# EAGLE schematic Mod Matrix Mixer 2x4x2 (EAGLE 6.1)
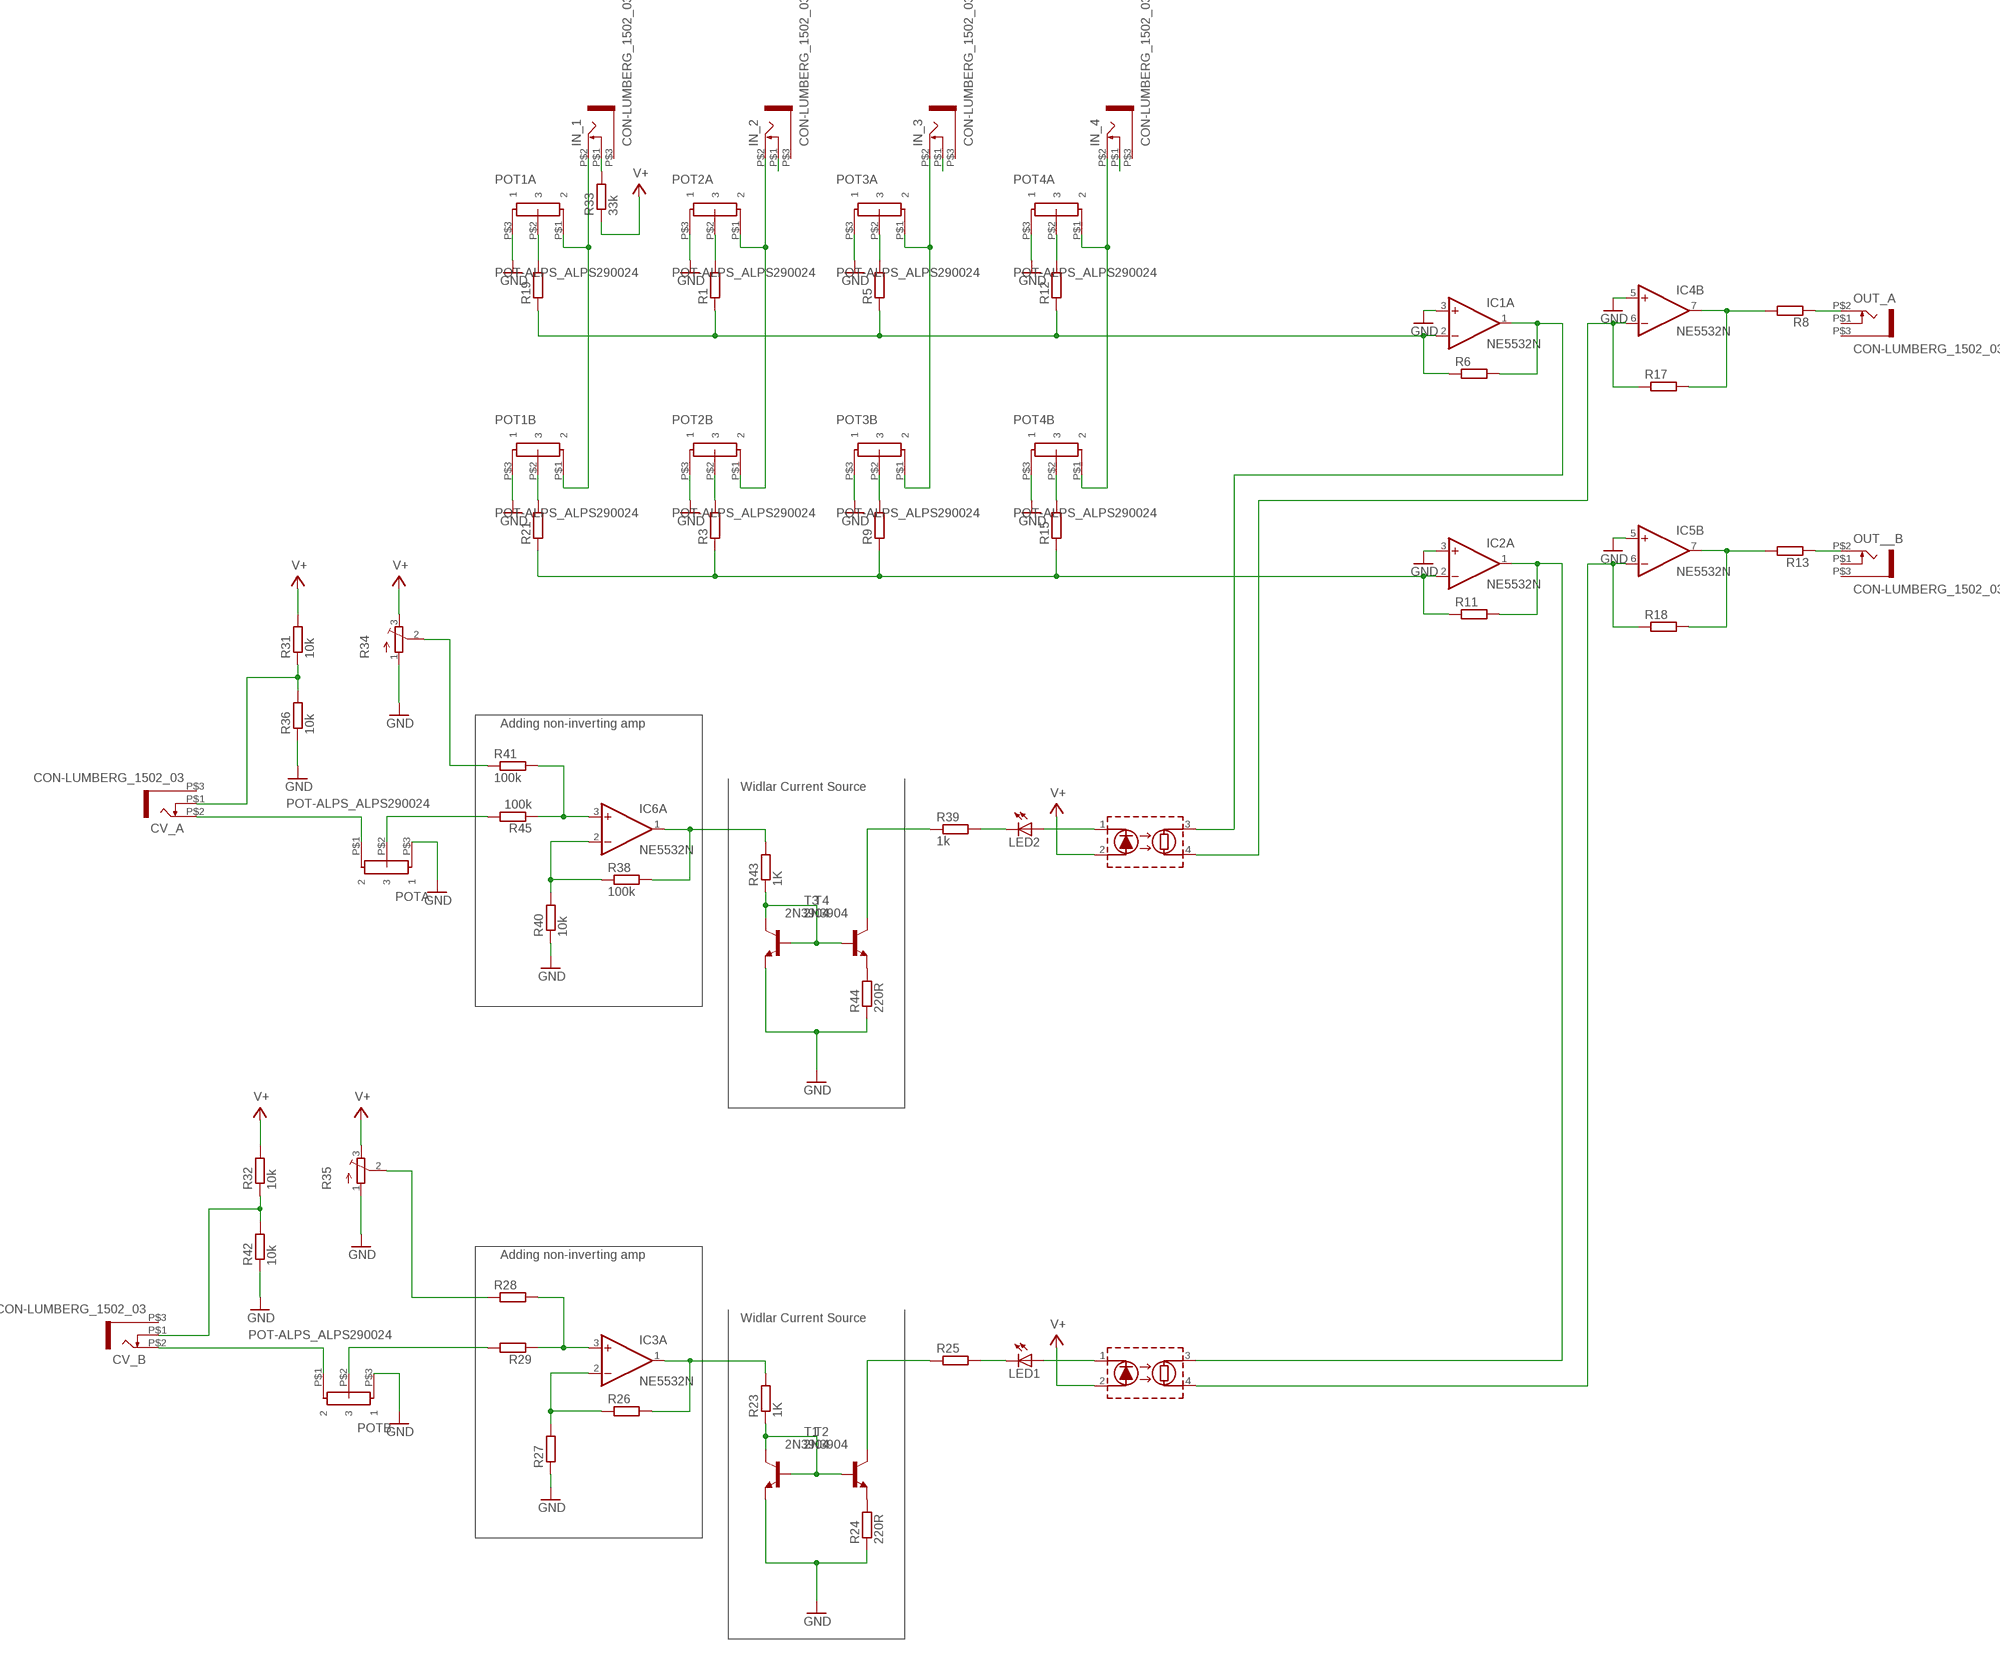
[diagram p0: schematic, sheet 1]

## Parts
CV_A  CON-LUMBERG_1502_03  [CON-LUMBERG_1502_03]
CV_B  CON-LUMBERG_1502_03  [CON-LUMBERG_1502_03]
IC1  NE5532N  [DIL08]
IC2  NE5532N  [DIL08]
IC3  NE5532N  [DIL08]
IC4  NE5532N  [DIL08]
IC5  NE5532N  [DIL08]
IC6  NE5532N  [DIL08]
IN_1  CON-LUMBERG_1502_03  [CON-LUMBERG_1502_03]
IN_2  CON-LUMBERG_1502_03  [CON-LUMBERG_1502_03]
IN_3  CON-LUMBERG_1502_03  [CON-LUMBERG_1502_03]
IN_4  CON-LUMBERG_1502_03  [CON-LUMBERG_1502_03]
LED1  LED5MM  [LED5MM]
LED2  LED5MM  [LED5MM]
OUT__B  CON-LUMBERG_1502_03  [CON-LUMBERG_1502_03]
OUT_A  CON-LUMBERG_1502_03  [CON-LUMBERG_1502_03]
POT1A  POT-ALPS_ALPS290024  [POT-ALPS_POT]
POT1B  POT-ALPS_ALPS290024  [POT-ALPS_POT]
POT2A  POT-ALPS_ALPS290024  [POT-ALPS_POT]
POT2B  POT-ALPS_ALPS290024  [POT-ALPS_POT]
POT3A  POT-ALPS_ALPS290024  [POT-ALPS_POT]
POT3B  POT-ALPS_ALPS290024  [POT-ALPS_POT]
POT4A  POT-ALPS_ALPS290024  [POT-ALPS_POT]
POT4B  POT-ALPS_ALPS290024  [POT-ALPS_POT]
POTA  POT-ALPS_ALPS290024  [POT-ALPS_POT]
POTB  POT-ALPS_ALPS290024  [POT-ALPS_POT]
R1  R-EU_0411/15  [0411/15]
R3  R-EU_0411/15  [0411/15]
R5  R-EU_0411/15  [0411/15]
R6  R-EU_0411/15  [0411/15]
R8  R-EU_0411/15  [0411/15]
R9  R-EU_0411/15  [0411/15]
R11  R-EU_0411/15  [0411/15]
R12  R-EU_0411/15  [0411/15]
R13  R-EU_0411/15  [0411/15]
R15  R-EU_0411/15  [0411/15]
R17  R-EU_0411/15  [0411/15]
R18  R-EU_0411/15  [0411/15]
R19  R-EU_0411/15  [0411/15]
R21  R-EU_0411/15  [0411/15]
R23  1K  R-EU_0411/15  [0411/15]
R24  220R  R-EU_0411/15  [0411/15]
R25  R-EU_0411/15  [0411/15]
R26  R-EU_0411/15  [0411/15]
R27  R-EU_0411/15  [0411/15]
R28  R-EU_0411/15  [0411/15]
R29  R-EU_0411/15  [0411/15]
R31  10k  R-EU_0411/15  [0411/15]
R32  10k  R-EU_0411/15  [0411/15]
R33  33k  R-EU_0411/15  [0411/15]
R34  TRIM_EU-3223W  [3223W]
R35  TRIM_EU-3223W  [3223W]
R36  10k  R-EU_0411/15  [0411/15]
R38  100k  R-EU_0411/15  [0411/15]
R39  1k  R-EU_0411/15  [0411/15]
R40  10k  R-EU_0411/15  [0411/15]
R41  100k  R-EU_0411/15  [0411/15]
R42  10k  R-EU_0411/15  [0411/15]
R43  1K  R-EU_0411/15  [0411/15]
R44  220R  R-EU_0411/15  [0411/15]
R45  100k  R-EU_0411/15  [0411/15]
T1  2N3904  [TO92]
T2  2N3904  [TO92]
T3  2N3904  [TO92]
T4  2N3904  [TO92]
U$1  VTL5C3  [VTL5C3]
U$2  VTL5C3  [VTL5C3]

## Nets
GND: IC1.3(A:+IN) IC2.3(A:+IN) IC4.5(B:+IN) IC5.5(B:+IN) POT1A.P$3 POT1B.P$3 POT2A.P$3 POT2B.P$3 POT3A.P$3 POT3B.P$3 POT4A.P$3 POT4B.P$3 POTA.P$3 POTB.P$3 R24.1 R27.1 R34.1(A) R35.1(A) R36.1 R40.1 R42.1 R44.1 T2.3(E) T4.3(E)
IN_C: IN_3.P$1
N$1: IC4.7(B:OUT) R8.2 R17.2
N$2: IN_2.P$2 POT2A.P$1 POT2B.P$1
N$3: IC2.1(A:OUT) R11.2 U$1.3(LDRA)
N$4: IC1.1(A:OUT) R6.2 U$2.3(LDRA)
N$5: OUT_A.P$2 R8.1
N$6: OUT__B.P$2 R13.1
N$7: POT1A.P$2 R19.2
N$8: POT1B.P$2 R21.2
N$10: IN_2.P$1
N$11: IC4.6(B:-IN) R17.1 U$2.4(LDRB)
N$12: POT2A.P$2 R1.2
N$13: POT2B.P$2 R3.2
N$14: IC5.7(B:OUT) R13.2 R18.2
N$15: LED1.A U$1.1(LED-)
N$16: LED1.K(C) R25.2
N$17: IC3.1(A:OUT) R23.2 R26.2
N$18: POTA.P$2 R45.2
N$19: IN_3.P$2 POT3A.P$1 POT3B.P$1
N$21: POT3A.P$2 R5.2
N$22: POT3B.P$2 R9.2
N$23: CV_A.P$2 POTA.P$1
N$24: CV_A.P$1 R31.1 R36.2
N$25: IN_4.P$2 POT4A.P$1 POT4B.P$1
N$26: IN_1.P$2 POT1A.P$1 POT1B.P$1
N$27: R24.2 T1.3(E)
N$28: R23.1 T1.2(B) T2.1(C) T2.2(B)
N$29: R25.1 T1.1(C)
N$30: IC3.2(A:-IN) R26.1 R27.2
N$31: R28.1 R35.2(S)
N$32: IC3.3(A:+IN) R28.2 R29.1
N$34: IN_4.P$1
N$35: R44.2 T3.3(E)
N$36: IC5.6(B:-IN) R18.1 U$1.4(LDRB)
N$37: POTB.P$2 R29.2
N$38: CV_B.P$2 POTB.P$1
N$39: LED2.A U$2.1(LED-)
N$40: LED2.K(C) R39.2
N$41: R39.1 T3.1(C)
N$42: IC6.1(A:OUT) R38.2 R43.2
N$43: IN_1.P$1 R33.2
N$44: R43.1 T3.2(B) T4.1(C) T4.2(B)
N$45: POT4A.P$2 R12.2
N$46: POT4B.P$2 R15.2
N$47: CV_B.P$1 R32.1 R42.2
N$48: IC6.2(A:-IN) R38.1 R40.2
N$50: IC6.3(A:+IN) R41.2 R45.1
N$51: R34.2(S) R41.1
N$52: IC1.2(A:-IN) R1.1 R5.1 R6.1 R12.1 R19.1
N$54: IC2.2(A:-IN) R3.1 R9.1 R11.1 R15.1 R21.1
V+: R31.2 R32.2 R33.1 R34.3(E) R35.3(E) U$1.2(LED+) U$2.2(LED+)
Unconnected: CV_A.P$3 CV_B.P$3 IC1.5(B:+IN) IC1.6(B:-IN) IC1.7(B:OUT) IC2.5(B:+IN) IC2.6(B:-IN) IC2.7(B:OUT) IC3.5(B:+IN) IC3.6(B:-IN) IC3.7(B:OUT) IC4.1(A:OUT) IC4.2(A:-IN) IC4.3(A:+IN) IC5.1(A:OUT) IC5.2(A:-IN) IC5.3(A:+IN) IC6.5(B:+IN) IC6.6(B:-IN) IC6.7(B:OUT) IN_1.P$3 IN_2.P$3 IN_3.P$3 IN_4.P$3 OUT__B.P$1 OUT__B.P$3 OUT_A.P$1 OUT_A.P$3

## Notes on the sheet
- Adding non-inverting amp
- Widlar Current Source
- Adding non-inverting amp
- Widlar Current Source

## Power pins joined to a net without a drawn wire
V+: IC1.8(P:V+) IC2.8(P:V+) IC3.8(P:V+) IC4.8(P:V+) IC5.8(P:V+) IC6.8(P:V+)
V-: IC1.4(P:V-) IC2.4(P:V-) IC3.4(P:V-) IC4.4(P:V-) IC5.4(P:V-) IC6.4(P:V-)

## Library data of the parts
CV_A CV_B IN_1-IN_4 OUT__B OUT_A = Rebel:CON-LUMBERG_1502_03
IC1-IC6 = linear:NE5532: AUDIO AMPLIFIER
LED1 LED2 = led:LED: LED OSRAM: - CHIPLED LG R971, LG N971, LY N971, LG Q971, LY Q971, LO R971, LY R971 LH N974, LH R974 LS Q976, LO Q976, LY Q976 LO Q996 - Hyper CHIPLED LW Q18S LB Q993, LB Q99A, LB R99A - SideLED LS A670, LO A670, LY A670, LG A670, LP A670 LB A673, LV A673, LT A673, LW A673 LH A674 LY A675 LS A676, LA A676, LO A676, LY A676, LW A676 LS A679, LY A679, LG A679 - Hyper Micro SIDELED® LS Y876, LA Y876, LO Y876, LY Y876 LT Y87S - SmartLED LW L88C, LW L88S LB L89C, LB L89S, LG L890 LS L89K, LO L89K, LY L89K LS L896, LA L896, LO L896, LY L896 - TOPLED LS T670, LO T670, LY T670, LG T670, LP T670 LSG T670, LSP T670, LSY T670, LOP T670, LYG T670 LG T671, LOG T671, LSG T671 LB T673, LV T673, LT T673, LW T673 LH T674 LS T676, LA T676, LO T676, LY T676, LB T676, LH T676, LSB T676, LW T676 LB T67C, LV T67C, LT T67C, LS T67K, LO T67K, LY T67K, LW E67C LS E67B, LA E67B, LO E67B, LY E67B, LB E67C, LV E67C, LT E67C LW T67C LS T679, LY T679, LG T679 LS T770, LO T770, LY T770, LG T770, LP T770 LB T773, LV T773, LT T773, LW T773 LH T774 LS E675, LA E675, LY E675, LS T675 LS T776, LA T776, LO T776, LY T776, LB T776 LHGB T686 LT T68C, LB T68C - Hyper Mini TOPLED® LB M676 - Mini TOPLED Santana® LG M470 LS M47K, LO M47K, LY M47K Source: http://www.osram.convergy.de LUXEON: - LUMILED® LXK2-PW12-R00, LXK2-PW12-S00, LXK2-PW14-U00, LXK2-PW14-V00 LXK2-PM12-R00, LXK2-PM12-S00, LXK2-PM14-U00 LXK2-PE12-Q00, LXK2-PE12-R00, LXK2-PE12-S00, LXK2-PE14-T00, LXK2-PE14-U00 LXK2-PB12-K00, LXK2-PB12-L00, LXK2-PB12-M00, LXK2-PB14-N00, LXK2-PB14-P00, LXK2-PB14-Q00 LXK2-PR12-L00, LXK2-PR12-M00, LXK2-PR14-Q00, LXK2-PR14-R00 LXK2-PD12-Q00, LXK2-PD12-R00, LXK2-PD12-S00 LXK2-PH12-R00, LXK2-PH12-S00 LXK2-PL12-P00, LXK2-PL12-Q00, LXK2-PL12-R00 Source: www.luxeon.com KINGBRIGHT: KA-3528ASYC Source: www.kingbright.com
POT1A POT1B POT2A POT2B POT3A POT3B POT4A POT4B POTA POTB = Rebel:POT-ALPS_ALPS290024
R1 R3 R5 R6 R8 R9 R11-R13 R15 R17-R19 R21 R23-R29 R31-R33 R36 R38-R45 = resistor:R-EU_: RESISTOR, European symbol
R34 R35 = pot:TRIM_EU-: POTENTIOMETER
T1-T4 = transistor:2N3904: NPN TRANSISTOR
U$1 U$2 = Pingdynasty:VTL5C3